# Altium project STM32G4_DRV8301_hardware.PrjPcb (part 4 of 5)

## Sheet DRV8301_SENSE.SchDoc
size 594 x 420 mm; SheetNumber: 7; SheetTotal: 9
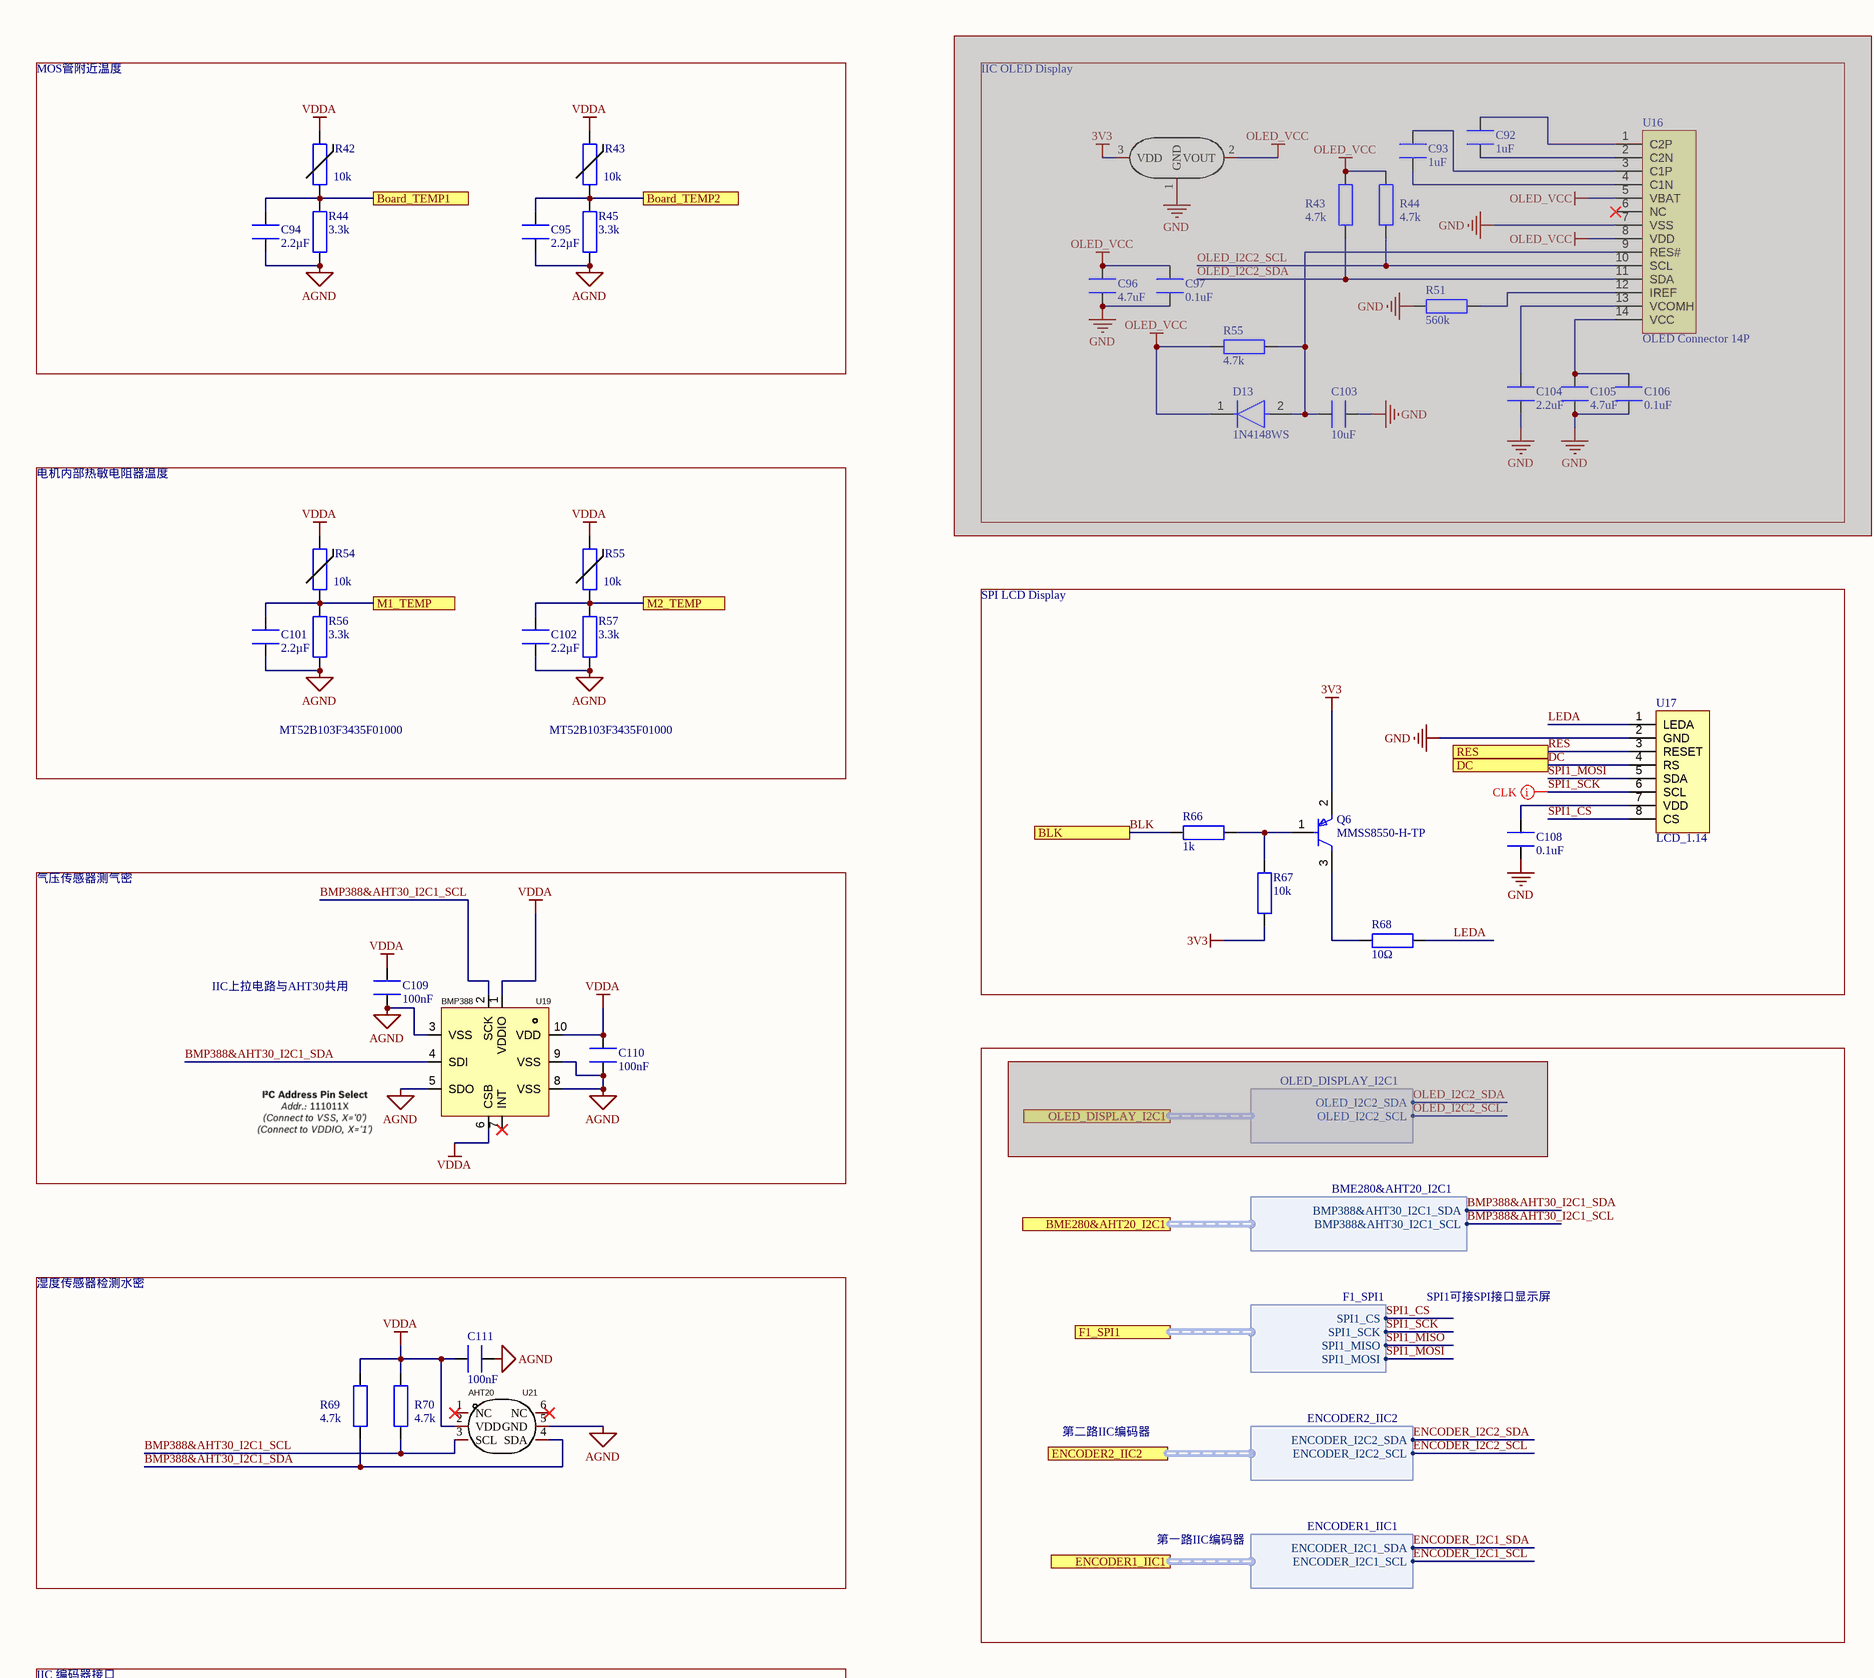
[diagram p9: DRV8301_SENSE.SchDoc, top left]
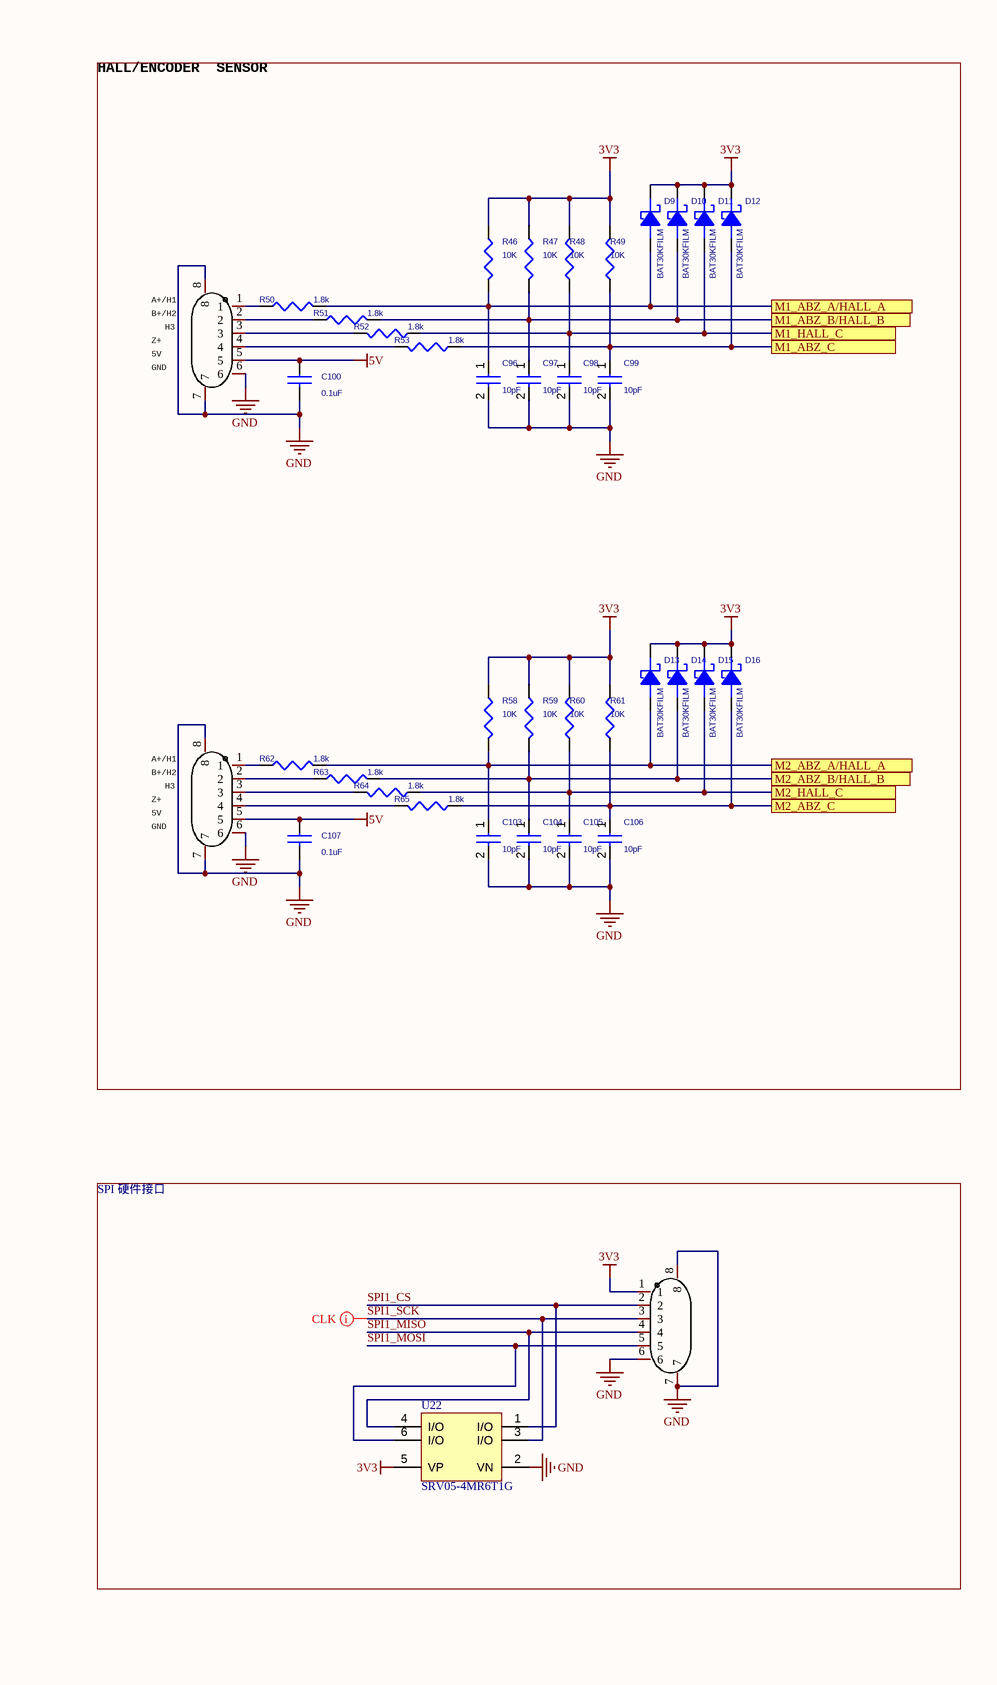
[diagram p10: DRV8301_SENSE.SchDoc, top right]
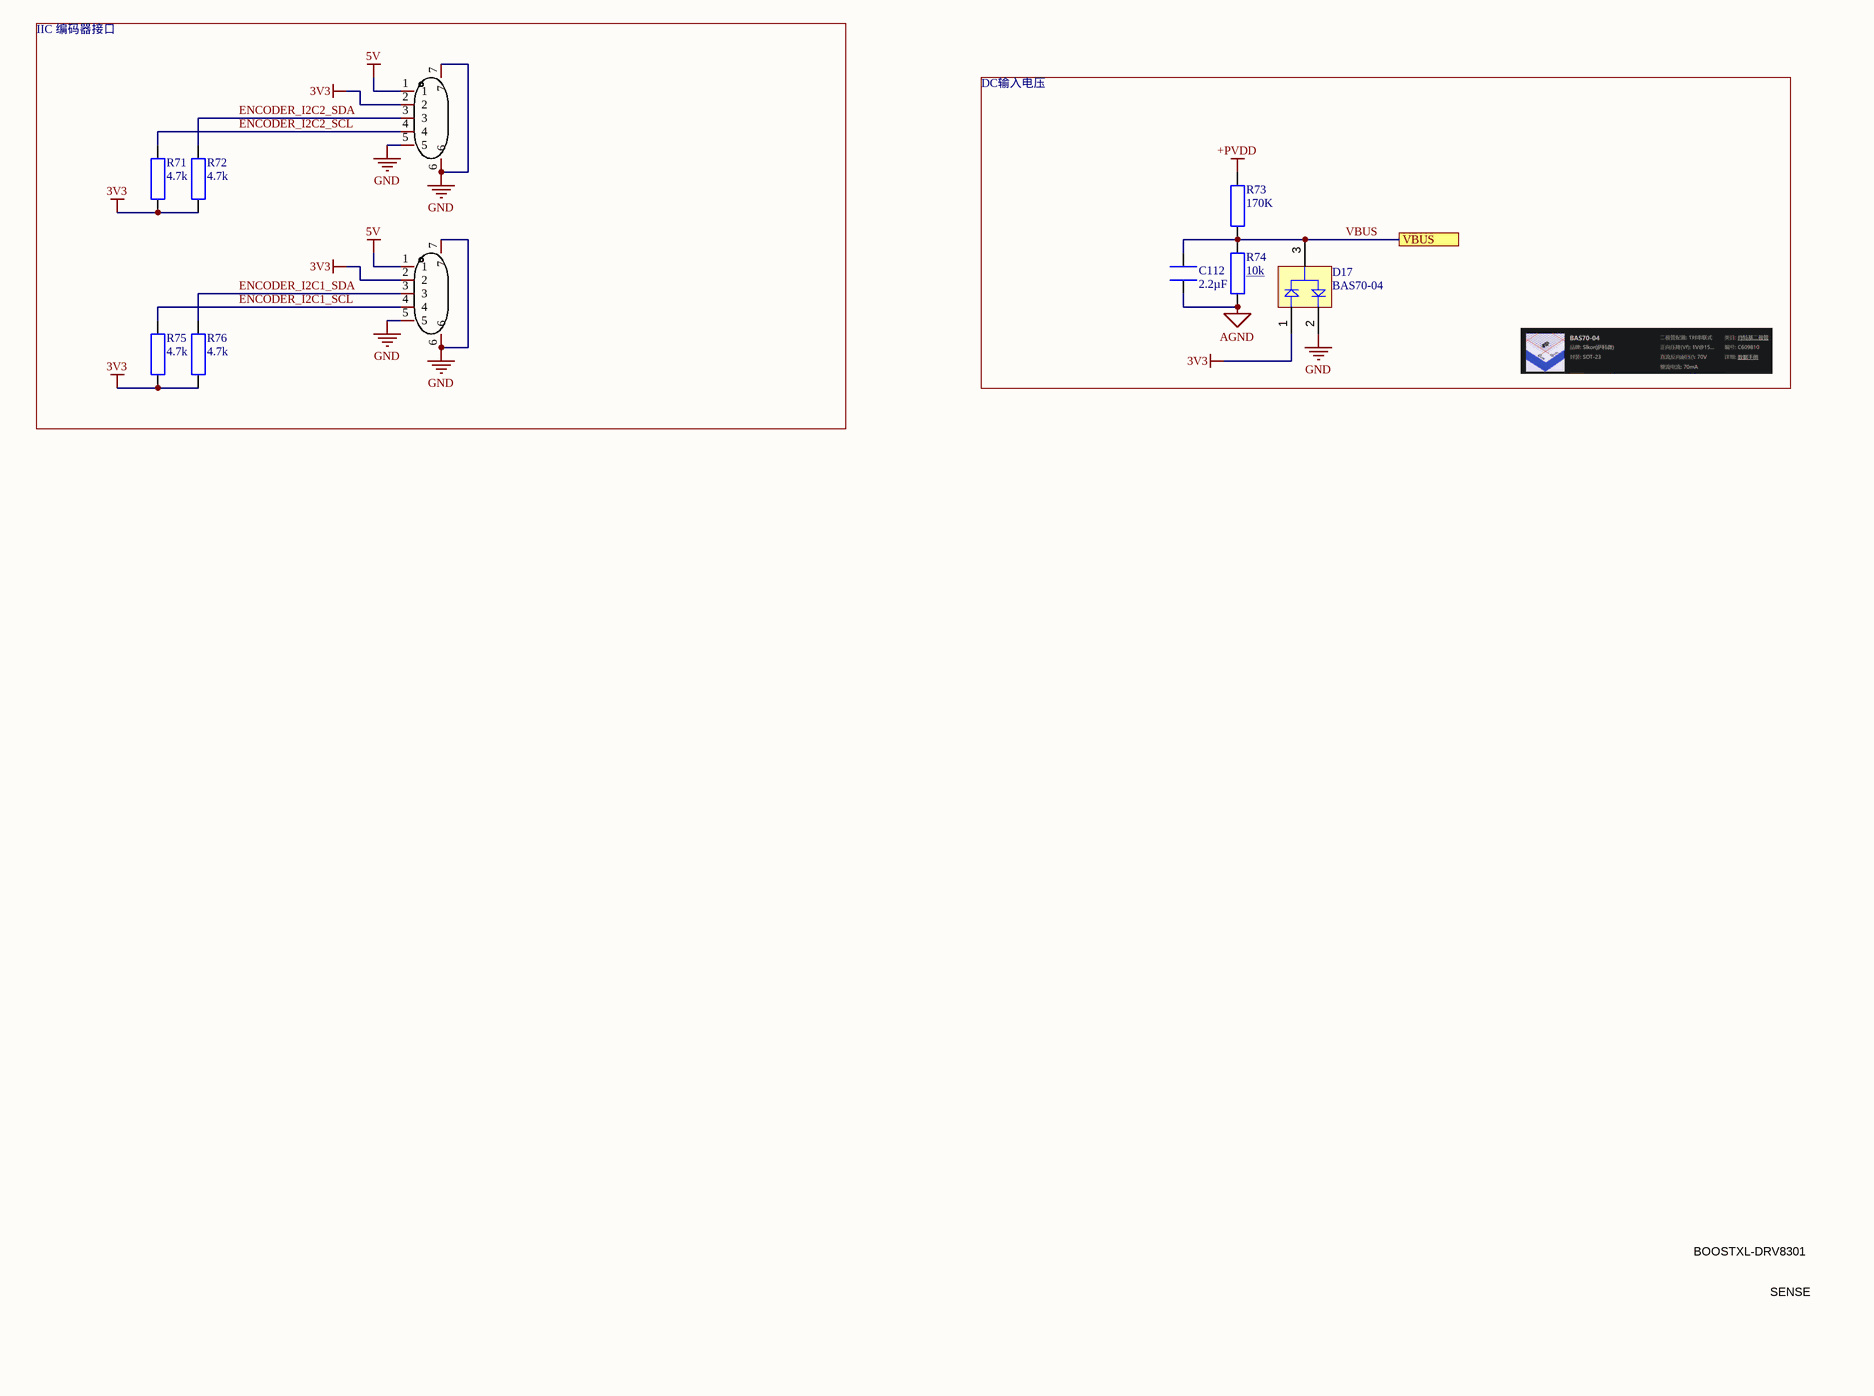
[diagram p11: DRV8301_SENSE.SchDoc, bottom left]
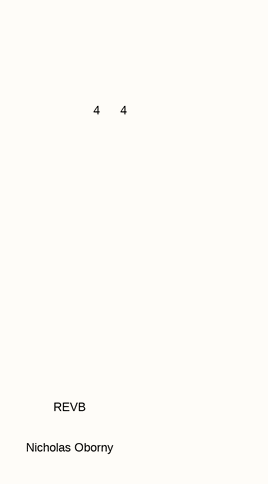
[diagram p12: DRV8301_SENSE.SchDoc, bottom right]

### Parts
(Parts that share a designator on the sheet are numbered #1, #2 ... from top to bottom, then left to right.)
C92#1  1uF  [CAPC1608X09L]  (masked out: inside a compile mask, not in the netlist)
C93#1  1uF  [CAPC1608X09L]  (masked out: inside a compile mask, not in the netlist)
C94  2.2µF  [CAPC1608X09L]
C95  2.2µF  [CAPC1608X09L]
C96#1  4.7uF  [CAPC1608X09L]  (masked out: inside a compile mask, not in the netlist)
C96#2  10pF  [C_0402]
C97#1  0.1uF  [CAPC1608X09L]  (masked out: inside a compile mask, not in the netlist)
C97#2  10pF  [C_0402]
C98  10pF  [C_0402]
C99  10pF  [C_0402]
C100  0.1uF  [C_0402]
C101  2.2µF  [CAPC1608X09L]
C102  2.2µF  [CAPC1608X09L]
C103#1  10uF  [CAPC1608X09L]  (masked out: inside a compile mask, not in the netlist)
C103#2  10pF  [C_0402]
C104#1  2.2uF  [CAPC1608X09L]  (masked out: inside a compile mask, not in the netlist)
C104#2  10pF  [C_0402]
C105#1  4.7uF  [CAPC1608X09L]  (masked out: inside a compile mask, not in the netlist)
C105#2  10pF  [C_0402]
C106#1  0.1uF  [CAPC1608X09L]  (masked out: inside a compile mask, not in the netlist)
C106#2  10pF  [C_0402]
C107  0.1uF  [C_0402]
C108  0.1uF  [CAPC1608X09L]
C109  100nF  [CAPC1608X09L]
C110  100nF  [CAPC1608X09L]
C111  100nF  [CAPC1608X09L]
C112  2.2µF  [CAPC1608X09L]
D9  BAT30KFILM  [sodfl160x80x65l30x30n]
D10  BAT30KFILM  [sodfl160x80x65l30x30n]
D11  BAT30KFILM  [sodfl160x80x65l30x30n]
D12  BAT30KFILM  [sodfl160x80x65l30x30n]
D13#1  1N4148WS  [FP-477AB-IPC_C]  (masked out: inside a compile mask, not in the netlist)
D13#2  BAT30KFILM  [sodfl160x80x65l30x30n]
D14  BAT30KFILM  [sodfl160x80x65l30x30n]
D15  BAT30KFILM  [sodfl160x80x65l30x30n]
D16  BAT30KFILM  [sodfl160x80x65l30x30n]
D17  BAS70-04  [INF-SOT23_N]
Q6  MMSS8550-H-TP  [FP-SOT-23-IPC_B]
R42  10k  [RESC1005X40N]
R43#1  10k  [RESC1005X40N]
R43#2  4.7k  [RESC1608X55N]  (masked out: inside a compile mask, not in the netlist)
R44#1  3.3k  [RESC1608X55N]
R44#2  4.7k  [RESC1608X55N]  (masked out: inside a compile mask, not in the netlist)
R45  3.3k  [RESC1608X55N]
R46  10K  [R_0402]
R47  10K  [R_0402]
R48  10K  [R_0402]
R49  10K  [R_0402]
R50  1.8k  [R_0402]
R51#1  560k  [RESC1608X55N]  (masked out: inside a compile mask, not in the netlist)
R51#2  1.8k  [R_0402]
R52  1.8k  [R_0402]
R53  1.8k  [R_0402]
R54  10k  [RESC1005X40N]
R55#1  4.7k  [RESC1608X55N]  (masked out: inside a compile mask, not in the netlist)
R55#2  10k  [RESC1005X40N]
R56  3.3k  [RESC1608X55N]
R57  3.3k  [RESC1608X55N]
R58  10K  [R_0402]
R59  10K  [R_0402]
R60  10K  [R_0402]
R61  10K  [R_0402]
R62  1.8k  [R_0402]
R63  1.8k  [R_0402]
R64  1.8k  [R_0402]
R65  1.8k  [R_0402]
R66  1k  [RESC1608X55N]
R67  10k  [RESC1608X55N]
R68  10Ω  [RESC1608X55N]
R69  4.7k  [RESC1608X55N]
R70  4.7k  [RESC1608X55N]
R71  4.7k  [RESC1608X55N]
R72  4.7k  [RESC1608X55N]
R73  170K  [RESC1608X55N]
R74  10k  [RESC1608X55N]
R75  4.7k  [RESC1608X55N]
R76  4.7k  [RESC1608X55N]
U16#1  OLED Connector 14P  [OLED 14P Connector]  (masked out: inside a compile mask, not in the netlist)
U16#2  WAFER-GH1.25-6PWB  [CONN-SMD_6P-P1.25_XUNPU_WAFER-GH1.25-6PWB]  (value not drawn)
U17#1  662K  [SOT-23-3_L2.9-W1.3-P1.90-LS2.4-BR]  (value not drawn)  (masked out: inside a compile mask, not in the netlist)
U17#2  LCD_1.14  [IPS 8P Connector]
U18  WAFER-GH1.25-6PWB  [CONN-SMD_6P-P1.25_XUNPU_WAFER-GH1.25-6PWB]  (value not drawn)
U19  BMP388  [SENSORM-SMD_BMP388]
U20  WAFER-GH1.25-6PWB  [CONN-SMD_6P-P1.25_XUNPU_WAFER-GH1.25-6PWB]  (value not drawn)
U21  AHT20  [SENSOR-SMD_L3.0-W3.0-P1.00-BR]
U22  SRV05-4MR6T1G  [ONSC-TSOP-6-318G-02_V]
U23  WAFER-GH1.25-5PWB  [CONN-SMD_5P-P1.25_XUNPU_WAFER-GH1.25-5PWB]  (value not drawn)
U24  WAFER-GH1.25-5PWB  [CONN-SMD_5P-P1.25_XUNPU_WAFER-GH1.25-5PWB]  (value not drawn)

### Blocks framed on the sheet
MOS管附近温度: C94 C95 R42 R43#1 R44#1 R45
IIC OLED Display: C92#1 C93#1 C96#1 C97#1 C103#1 C104#1 C105#1 C106#1 D13#1 R43#2 R44#2 R51#1 R55#1 U16#1 U17#1
HALL/ENCODER  SENSOR: C96#2 C97#2 C98-C100 C103#2 C104#2 C105#2 C106#2 C107 D9-D12 D13#2 D14-D16 R46-R50 R51#2 R52 R53 R58-R65 U16#2 U18
SPI LCD Display: C108 Q6 R66-R68 U17#2
SPI 硬件接口: U20 U22
湿度传感器检测水密: C111 R69 R70 U21
IIC 编码器接口: R71 R72 R75 R76 U23 U24
DC输入电压: C112 D17 R73 R74

### Ports
BLK (see STM32G4_DRV8301_hardware_TOP_V1.0[4A]), BME280&AHT20_I2C1 (harness BME280&AHT20_I2C1, see STM32G4_DRV8301_hardware_TOP_V1.0[4B], STM32F1_microcontroller[6B]), Board_TEMP1 (see STM32G4_DRV8301_hardware_TOP_V1.0[4A]), Board_TEMP2 (see STM32G4_DRV8301_hardware_TOP_V1.0[4A]), DC (see STM32G4_DRV8301_hardware_TOP_V1.0[4A]), ENCODER1_IIC1 (harness ENCODER1_IIC1, see STM32G4_DRV8301_hardware_TOP_V1.0[4B], STM32G4_microcontroller[6B]), ENCODER2_IIC2 (harness ENCODER2_IIC2, see STM32G4_DRV8301_hardware_TOP_V1.0[4B], STM32G4_microcontroller[1B]), F1_SPI1 (harness F1_SPI1, see STM32G4_DRV8301_hardware_TOP_V1.0[4B], STM32F1_microcontroller[1B]), M1_ABZ_A/HALL_A (see STM32G4_DRV8301_hardware_TOP_V1.0[4A]), M1_ABZ_B/HALL_B (see STM32G4_DRV8301_hardware_TOP_V1.0[4A]), M1_ABZ_C (see STM32G4_DRV8301_hardware_TOP_V1.0[4A]), M1_HALL_C (see STM32G4_DRV8301_hardware_TOP_V1.0[4A]), M1_TEMP (see STM32G4_DRV8301_hardware_TOP_V1.0[4A]), M2_ABZ_A/HALL_A (see STM32G4_DRV8301_hardware_TOP_V1.0[4A]), M2_ABZ_B/HALL_B (see STM32G4_DRV8301_hardware_TOP_V1.0[4A]), M2_ABZ_C (see STM32G4_DRV8301_hardware_TOP_V1.0[4B]), M2_HALL_C (see STM32G4_DRV8301_hardware_TOP_V1.0[4B]), M2_TEMP (see STM32G4_DRV8301_hardware_TOP_V1.0[4A]), OLED_DISPLAY_I2C1 (harness OLED_DISPLAY_I2C1, see STM32G4_DRV8301_hardware_TOP_V1.0[4B], STM32F1_microcontroller[6B]), RES (see STM32G4_DRV8301_hardware_TOP_V1.0[4A]), VBUS (see STM32G4_DRV8301_hardware_TOP_V1.0[4A])

### Harnesses
OLED_DISPLAY_I2C1: OLED_I2C2_SDA, OLED_I2C2_SCL
BME280&AHT20_I2C1: BMP388&AHT30_I2C1_SDA, BMP388&AHT30_I2C1_SCL
F1_SPI1: SPI1_CS, SPI1_SCK, SPI1_MISO, SPI1_MOSI
ENCODER2_IIC2: ENCODER_I2C2_SDA, ENCODER_I2C2_SCL
ENCODER1_IIC1: ENCODER_I2C1_SDA, ENCODER_I2C1_SCL

### Nets
3V3: D9.C D10.C D11.C D12.C D13#2.C D14.C D15.C D16.C D17.1(A1) Q6.2(E) R46.1 R47.1 R48.2 R49.2 R58.1 R59.1 R60.2 R61.2 R67.1 R71.2 R72.2 R75.2 R76.2 U20.1 U22.5(VP) U23.2 U24.2
5V: C100.1 C107.1 U16#2.5 U18.5 U23.1 U24.1
+PVDD: R73.2
AGND: C94.1 C95.1 C101.1 C102.1 C109.1 C110.1 C111.1 C112.1 R44#1.2 R45.2 R56.2 R57.2 R74.1 U19.3(VSS) U19.5(SDO) U19.8(VSS) U19.9(VSS) U21.5(GND)
GND: C96#2.2 C97#2.2 C98.2 C99.2 C100.2 C103#2.2 C104#2.2 C105#2.2 C106#2.2 C107.2 C108.1 D17.2(K2) U16#2.6 U16#2.7 U16#2.8 U17#2.2(GND) U18.6 U18.7 U18.8 U20.6 U20.7 U20.8 U22.2(VN) U23.5 U23.6 U23.7 U24.5 U24.6 U24.7
VDDA: C109.2 C110.2 C111.2 R42.2 R43#1.2 R54.2 R55#2.2 R69.2 R70.2 U19.1(VDDIO) U19.6(CSB) U19.10(VDD) U21.2(VDD)
BLK: R66.2 ; port BLK
BMP388&AHT30_I2C1_SCL: R70.1 U19.2(SCK) U21.3(SCL) ; port BME280&AHT20_I2C1.BMP388&AHT30_I2C1_SCL
BMP388&AHT30_I2C1_SDA: R69.1 U19.4(SDI) U21.4(SDA) ; port BME280&AHT20_I2C1.BMP388&AHT30_I2C1_SDA
DC: U17#2.4(RS) ; port DC
ENCODER_I2C1_SCL: R75.1 U24.4 ; port ENCODER1_IIC1.ENCODER_I2C1_SCL
ENCODER_I2C1_SDA: R76.1 U24.3 ; port ENCODER1_IIC1.ENCODER_I2C1_SDA
ENCODER_I2C2_SCL: R71.1 U23.4 ; port ENCODER2_IIC2.ENCODER_I2C2_SCL
ENCODER_I2C2_SDA: R72.1 U23.3 ; port ENCODER2_IIC2.ENCODER_I2C2_SDA
LEDA: R68.2 U17#2.1(LEDA)
RES: U17#2.3(RESET) ; port RES
SPI1_CS: U17#2.8(CS) U20.2 U22.1(I/O) ; port F1_SPI1.SPI1_CS
SPI1_MISO: U20.4 U22.4(I/O) ; port F1_SPI1.SPI1_MISO
SPI1_MOSI: U17#2.5(SDA) U20.5 U22.6(I/O) ; port F1_SPI1.SPI1_MOSI
SPI1_SCK: U17#2.6(SCL) U20.3 U22.3(I/O) ; port F1_SPI1.SPI1_SCK
VBUS: C112.2 D17.3(C) R73.1 R74.2 ; port VBUS
NetC94_2: C94.2 R42.1 R44#1.1 ; port Board_TEMP1
NetC95_2: C95.2 R43#1.1 R45.1 ; port Board_TEMP2
NetC96#2_1: C96#2.1 D9.A R46.2 R50.2 ; port M1_ABZ_A/HALL_A
NetC97#2_1: C97#2.1 D10.A R47.2 R51#2.2 ; port M1_ABZ_B/HALL_B
NetC98_1: C98.1 D11.A R48.1 R52.1 ; port M1_HALL_C
NetC99_1: C99.1 D12.A R49.1 R53.1 ; port M1_ABZ_C
NetC101_2: C101.2 R54.1 R56.1 ; port M1_TEMP
NetC102_2: C102.2 R55#2.1 R57.1 ; port M2_TEMP
NetC103#2_1: C103#2.1 D13#2.A R58.2 R62.2 ; port M2_ABZ_A/HALL_A
NetC104#2_1: C104#2.1 D14.A R59.2 R63.2 ; port M2_ABZ_B/HALL_B
NetC105#2_1: C105#2.1 D15.A R60.1 R64.1 ; port M2_HALL_C
NetC106#2_1: C106#2.1 D16.A R61.1 R65.1 ; port M2_ABZ_C
NetC108_2: C108.2 U17#2.7(VDD)
NetQ6_1: Q6.1(B) R66.1 R67.2
NetQ6_3: Q6.3(C) R68.1
NetR50_1: R50.1 U16#2.1
NetR51#2_1: R51#2.1 U16#2.2
NetR52_2: R52.2 U16#2.3
NetR53_2: R53.2 U16#2.4
NetR62_1: R62.1 U18.1
NetR63_1: R63.1 U18.2
NetR64_2: R64.2 U18.3
NetR65_2: R65.2 U18.4

Not connected (* = marked no-connect by the designer): U19 7(INT)*; U21 1(NC)* 6(NC)*

### Layout directives
mark named CLK: SPI1_SCK

### Notes on the sheet
- (near U16#2) A+/H1
- (near U16#2) 5V
- (near U16#2) B+/H2
- (near U16#2) GND
- (near U16#2) Z+
- (near U16#2) H3
- 电机内部热敏电阻器温度
- MT52B103F3435F01000
- (near U18) B+/H2
- (near U18) A+/H1
- (near U18) 5V
- (near U18) GND
- (near U18) Z+
- (near U18) H3
- 气压传感器测气密
- IIC上拉电路与AHT30共用
- SPI1可接SPI接口显示屏
- 第二路IIC编码器
- 第一路IIC编码器
- BOOSTXL-DRV8301
- SENSE
- 4
- REVB
- Nicholas Oborny
- DWG NO:
- REV:
- THIS DOCUMENT AND THE DATA DISCLOSED HEREIN OR
- HEREWITH IS THE PROPERTY OF ALTIUM LIMITED AND MAY
- BE FREELY DISTRIBUTED IN WHOLE. NO RIGHTS ARE
- RESERVED OR EXPRESS OR IMPLIED WARANTEE GIVEN.
- REVISION
- DESCRIPTION
- DATE
- APPROVED
- ENG:
- APPROVALS
- PROJECT
- DSN:
- CHK:
- REFERENCE DOCUMENTS
- PROJECT REVISION:
- TITLE
- DOCUMENT REVISION:
- DESIGN ITEM:
- BOM:
- FAB DWG:
- PCB DWG:
- ASSY DWG:
- SCALE:
- A2
- SIZE
- CAGE CODE
- FILE NAME
- DWG NO.
- SHEET
- OF
- REV

### Library data of the parts
C92#1 C93#1 = GRM188R61C225KE15D: CAP CER 1UF 16V X5R 0603; Manufacturer: Murata Electronics North America; Capacitance: 2.2µF; Tolerance: ±10%; Supplier 1: Digi-Key; Supplier Part Number 1: 490-3296-1-ND; Manufacturer Part Number: GRM188R61C225KE15D; RoHS: RoHS Compliant; Category: Capacitors; Stock 1: 1255740; Pricing 1: 1=0.12, 10=0.08, 50=0.046, 100=0.038, 250=0.032, 500=0.0268, 1000=0.022 (USD); Packaging: Cut Tape (CT); Voltage - Rated: 16V; Temperature Coefficient: X5R; Mounting Type: Surface Mount, MLCC; Operating Temperature: -55°C ~ 85°C; Applications: General Purpose; Ratings: -; Package / Case: 0603 (1608 Metric); Size / Dimension: 0.063" L x 0.031" W (1.60mm x 0.80mm); Height - Seated (Max): -; Thickness (Max): 0.035" (0.90mm); Lead Spacing: -; Features: -; Lead Style: -; ComponentLink1URL: http://www.murata.com/~/media/webrenewal/support/library/catalog/products/capacitor/mlcc/c02e.pdf; ComponentLink1Description: http://www.murata.com/~/media/webrenewal/support/library/catalog/products/capacitor/mlcc/c02e.pdf
C94 C95 C101 C102 C112 = GRM188R61C225KE15D: CAP CER 2.2UF 16V X5R 0603; Manufacturer: Murata Electronics North America; Tolerance: ±10%; Supplier 1: Digi-Key; Supplier Part Number 1: 490-3296-1-ND; Manufacturer Part Number: GRM188R61C225KE15D; RoHS: RoHS Compliant; Category: Capacitors; Stock 1: 1255740; Pricing 1: 1=0.12, 10=0.08, 50=0.046, 100=0.038, 250=0.032, 500=0.0268, 1000=0.022 (USD); Packaging: Cut Tape (CT); Capacitance: 2.2µF; Voltage - Rated: 16V; Temperature Coefficient: X5R; Mounting Type: Surface Mount, MLCC; Operating Temperature: -55°C ~ 85°C; Applications: General Purpose; Ratings: -; Package / Case: 0603 (1608 Metric); Size / Dimension: 0.063" L x 0.031" W (1.60mm x 0.80mm); Height - Seated (Max): -; Thickness (Max): 0.035" (0.90mm); Lead Spacing: -; Features: -; Lead Style: -; ComponentLink1URL: http://www.murata.com/~/media/webrenewal/support/library/catalog/products/capacitor/mlcc/c02e.pdf; ComponentLink1Description: http://www.murata.com/~/media/webrenewal/support/library/catalog/products/capacitor/mlcc/c02e.pdf
C96#1 C105#1 = GRM188R61C225KE15D: CAP CER 4.7UF 16V X5R 0603; Manufacturer: Murata Electronics North America; Capacitance: 2.2µF; Tolerance: ±10%; Supplier 1: Digi-Key; Supplier Part Number 1: 490-3296-1-ND; Manufacturer Part Number: GRM188R61C225KE15D; RoHS: RoHS Compliant; Category: Capacitors; Stock 1: 1255740; Pricing 1: 1=0.12, 10=0.08, 50=0.046, 100=0.038, 250=0.032, 500=0.0268, 1000=0.022 (USD); Packaging: Cut Tape (CT); Voltage - Rated: 16V; Temperature Coefficient: X5R; Mounting Type: Surface Mount, MLCC; Operating Temperature: -55°C ~ 85°C; Applications: General Purpose; Ratings: -; Package / Case: 0603 (1608 Metric); Size / Dimension: 0.063" L x 0.031" W (1.60mm x 0.80mm); Height - Seated (Max): -; Thickness (Max): 0.035" (0.90mm); Lead Spacing: -; Features: -; Lead Style: -; ComponentLink1URL: http://www.murata.com/~/media/webrenewal/support/library/catalog/products/capacitor/mlcc/c02e.pdf; ComponentLink1Description: http://www.murata.com/~/media/webrenewal/support/library/catalog/products/capacitor/mlcc/c02e.pdf
C96#2 C97#2 C98 C99 C103#2 C104#2 C105#2 C106#2 = CAP: CAP CER 10PF 10V C0G/NP0 0402; Manufacturer PN: 885012005007; Manufacturer: Wurth Electronics Inc.; PART_NUMBER: TMP-395; CLASS: DISCRETE; Tolerance: 5%; Temperature Coefficient: C0G, NP0; Dielectric Type: Capacitors; Rated Voltage: 10V; Package Size: 0402 (1005 Metric)
C97#1 C106#1 C108 = GRM188R61C225KE15D: CAP CER 0.1UF 16V X5R 0603; Manufacturer: Murata Electronics North America; Capacitance: 2.2µF; Tolerance: ±10%; Supplier 1: Digi-Key; Supplier Part Number 1: 490-3296-1-ND; Manufacturer Part Number: GRM188R61C225KE15D; RoHS: RoHS Compliant; Category: Capacitors; Stock 1: 1255740; Pricing 1: 1=0.12, 10=0.08, 50=0.046, 100=0.038, 250=0.032, 500=0.0268, 1000=0.022 (USD); Packaging: Cut Tape (CT); Voltage - Rated: 16V; Temperature Coefficient: X5R; Mounting Type: Surface Mount, MLCC; Operating Temperature: -55°C ~ 85°C; Applications: General Purpose; Ratings: -; Package / Case: 0603 (1608 Metric); Size / Dimension: 0.063" L x 0.031" W (1.60mm x 0.80mm); Height - Seated (Max): -; Thickness (Max): 0.035" (0.90mm); Lead Spacing: -; Features: -; Lead Style: -; ComponentLink1URL: http://www.murata.com/~/media/webrenewal/support/library/catalog/products/capacitor/mlcc/c02e.pdf; ComponentLink1Description: http://www.murata.com/~/media/webrenewal/support/library/catalog/products/capacitor/mlcc/c02e.pdf
C100 C107 = CAP_4: CAP CER 0.1UF 16V X7R 0402; Manufacturer PN: 885012205037; Manufacturer: Wurth Electronics Inc.; PART_NUMBER: CAP-00000053; CLASS: DISCRETE; Tolerance: 10%; Dielectric Type: Capacitors; Rated Voltage: 16V; Temperature Coefficient: X7R; Package Size: 0402 (1005 Metric)
C103#1 = GRM188R61C225KE15D: CAP CER 10UF 16V X5R 0603; Manufacturer: Murata Electronics North America; Capacitance: 2.2µF; Tolerance: ±10%; Supplier 1: Digi-Key; Supplier Part Number 1: 490-3296-1-ND; Manufacturer Part Number: GRM188R61C225KE15D; RoHS: RoHS Compliant; Category: Capacitors; Stock 1: 1255740; Pricing 1: 1=0.12, 10=0.08, 50=0.046, 100=0.038, 250=0.032, 500=0.0268, 1000=0.022 (USD); Packaging: Cut Tape (CT); Voltage - Rated: 16V; Temperature Coefficient: X5R; Mounting Type: Surface Mount, MLCC; Operating Temperature: -55°C ~ 85°C; Applications: General Purpose; Ratings: -; Package / Case: 0603 (1608 Metric); Size / Dimension: 0.063" L x 0.031" W (1.60mm x 0.80mm); Height - Seated (Max): -; Thickness (Max): 0.035" (0.90mm); Lead Spacing: -; Features: -; Lead Style: -; ComponentLink1URL: http://www.murata.com/~/media/webrenewal/support/library/catalog/products/capacitor/mlcc/c02e.pdf; ComponentLink1Description: http://www.murata.com/~/media/webrenewal/support/library/catalog/products/capacitor/mlcc/c02e.pdf
C104#1 = GRM188R61C225KE15D: CAP CER 2.2UF 16V X5R 0603; Manufacturer: Murata Electronics North America; Capacitance: 2.2µF; Tolerance: ±10%; Supplier 1: Digi-Key; Supplier Part Number 1: 490-3296-1-ND; Manufacturer Part Number: GRM188R61C225KE15D; RoHS: RoHS Compliant; Category: Capacitors; Stock 1: 1255740; Pricing 1: 1=0.12, 10=0.08, 50=0.046, 100=0.038, 250=0.032, 500=0.0268, 1000=0.022 (USD); Packaging: Cut Tape (CT); Voltage - Rated: 16V; Temperature Coefficient: X5R; Mounting Type: Surface Mount, MLCC; Operating Temperature: -55°C ~ 85°C; Applications: General Purpose; Ratings: -; Package / Case: 0603 (1608 Metric); Size / Dimension: 0.063" L x 0.031" W (1.60mm x 0.80mm); Height - Seated (Max): -; Thickness (Max): 0.035" (0.90mm); Lead Spacing: -; Features: -; Lead Style: -; ComponentLink1URL: http://www.murata.com/~/media/webrenewal/support/library/catalog/products/capacitor/mlcc/c02e.pdf; ComponentLink1Description: http://www.murata.com/~/media/webrenewal/support/library/catalog/products/capacitor/mlcc/c02e.pdf
C109-C111 = GRM188R61C225KE15D: CAP CER 100nF 16V X5R 0603; Manufacturer: Murata Electronics North America; Capacitance: 2.2µF; Tolerance: ±10%; Supplier 1: Digi-Key; Supplier Part Number 1: 490-3296-1-ND; Manufacturer Part Number: GRM188R61C225KE15D; RoHS: RoHS Compliant; Category: Capacitors; Stock 1: 1255740; Pricing 1: 1=0.12, 10=0.08, 50=0.046, 100=0.038, 250=0.032, 500=0.0268, 1000=0.022 (USD); Packaging: Cut Tape (CT); Voltage - Rated: 16V; Temperature Coefficient: X5R; Mounting Type: Surface Mount, MLCC; Operating Temperature: -55°C ~ 85°C; Applications: General Purpose; Ratings: -; Package / Case: 0603 (1608 Metric); Size / Dimension: 0.063" L x 0.031" W (1.60mm x 0.80mm); Height - Seated (Max): -; Thickness (Max): 0.035" (0.90mm); Lead Spacing: -; Features: -; Lead Style: -; ComponentLink1URL: http://www.murata.com/~/media/webrenewal/support/library/catalog/products/capacitor/mlcc/c02e.pdf; ComponentLink1Description: http://www.murata.com/~/media/webrenewal/support/library/catalog/products/capacitor/mlcc/c02e.pdf
D9 D11 D12 D13#2 D15 D16 = DIODE_SCHOTTKY_0: DIODE SCHOTTKY 30V 300MA SOD523; Manufacturer: STMicroelectronics; PART_NUMBER: TMP-46; CLASS: DISCRETE; Rated Voltage: 530mV @ 300mA; Manufacturer PN: BAT30KFILM; Package Size: SC-79, SOD-523
D10 D14 = DIODE_SCHOTTKY_0: DIODE SCHOTTKY 30V 300MA SOD523; PART_NUMBER: TMP-46; Manufacturer: STMicroelectronics; Rated Voltage: 530mV @ 300mA; CLASS: DISCRETE; Package Size: SC-79, SOD-523; Manufacturer PN: BAT30KFILM
D13#1 = CMP-07163-000040-1: DIODE GEN PURP 75V 150MA SOD323F; Forward Voltage: 1V; Power Dissipation: 200mW; Element Configuration: Single; Max Forward Surge Current (Ifsm): 2A; Peak Reverse Current: 5uA; Recovery Time: 4ns; Package Quantity: 1; Number of Pins: 2; Height: 1mm; REACH SVHC: No SVHC; Max Reverse Voltage (DC): 75V; Forward Current: 150mA; Length: 1.8mm; Max Repetitive Reverse Voltage (Vrrm): 75V; Max Operating Temperature: 150°C; Average Rectified Current: 150mA; Contact Plating: Tin; Packaging: Tape and Reel; Radiation Hardening: No; Min Operating Temperature: -55°C; Width: 1.35mm; Weight: 0.0276g; Lead Free: Lead Free; Mount: Surface Mount; Reverse Voltage: 75V; Reverse Recovery Time: 4ns
D17 = CMP-1182-00019-1: Silicon Schottky Diode, -55 to 125 degC, SOT23, Reel, Green; Manufacturer: Infineon; Configuration: Dual; IF (max): 70Â mA; VF (max): 1,000Â mV; CT (max): 2Â pF; VR (max): 70Â V; Green: TRUE; Packing: Reel; ComponentLink2Description: Datasheet; PartNumber: BAS70-04; PackageDescription: 3-Pin Small Outline Transistor Package, 1.3 x 2.9 mm Body, 0.95 mm Pitch; ComponentLink1URL: http://www.infineon.com/; ComponentLink3Description: Package Specification; PackageVersion: Apr-08; ComponentLink2URL: http://www.infineon.com/dgdl/bas70_bas170series.pdf?folderId=db3a30431400ef68011425f1ca2505e3&fileId=db3a304314dca389011518ad41680e12; ComponentLink3URL: http://www.infineon.com/dgdl/SOT23-Package_Overview.pdf?folderId=db3a30431936bc4b0119532290053c66&fileId=db3a30431936bc4b0119533468123c85; Mounting Technology: Surface Mount; ComponentLink1Description: Manufacturer URL; PackageReference: SOT23
Q6 = CMP-56214-000002-1: TRANS PNP 25V 1.5A SOT23; Emitter Base Voltage (VEBO): 1.6V; Collector Base Voltage (VCBO): 40V; Collector Emitter Saturation Voltage: 500mV; Max Power Dissipation: 625mW; Transition Frequency: 100MHz; Element Configuration: Single; hFE Min: 40; Polarity: PNP; Lead Free: Lead Free; Max Breakdown Voltage: 25V; Package Quantity: 1; Min Operating Temperature: -55°C; Case/Package: SOT-23; Max Collector Current: 1.5A; Mount: Surface Mount; Packaging: Tape and Reel; Collector Emitter Voltage (VCEO): 500mV; Max Operating Temperature: 150°C; Gain Bandwidth Product: 100MHz; Collector Emitter Breakdown Voltage: 25V
R42 R43#1 R54 R55#2 = NCP15XH103F03RC: THERMISTOR 10K OHM NTC 0402 SMD; Value: 10k
R43#2 R44#2 R55#1 R69-R72 R75 R76 = RC0603FR-073K3L: RES SMD 4.7K OHM 1% 1/10W 0603; Manufacturer: Yageo; Resistance (Ohms): 3.3k; Power (Watts): 0.1W, 1/10W; Temperature Coefficient: ±100ppm/°C; Supplier 1: Digi-Key; Supplier Part Number 1: 311-3.30KHRCT-ND; Manufacturer Part Number: RC0603FR-073K3L; RoHS: RoHS Compliant; Category: Resistors; Stock 1: 420019; Pricing 1: 1=0.1, 10=0.014, 25=0.01, 100=0.0057, 250=0.00436, 500=0.00348, 1000=0.00257, 2500=0.00223 (USD); Packaging: Cut Tape (CT); Tolerance: ±1%; Composition: Thick Film; Features: Moisture Resistant; Operating Temperature: -55°C ~ 155°C; Package / Case: 0603 (1608 Metric); Supplier Device Package: 0603; Size / Dimension: 0.063" L x 0.031" W (1.60mm x 0.80mm); Height: 0.022" (0.55mm); Number of Terminations: 2; ComponentLink1URL: http://www.yageo.com/documents/recent/PYu-RC_Group_51_RoHS_L_04.pdf; ComponentLink1Description: http://www.yageo.com/documents/recent/PYu-RC_Group_51_RoHS_L_04.pdf
R44#1 R45 R56 R57 = RC0603FR-073K3L: RES SMD 3.3K OHM 1% 1/10W 0603; Manufacturer: Yageo; Power (Watts): 0.1W, 1/10W; Temperature Coefficient: ±100ppm/°C; Supplier 1: Digi-Key; Supplier Part Number 1: 311-3.30KHRCT-ND; Manufacturer Part Number: RC0603FR-073K3L; RoHS: RoHS Compliant; Category: Resistors; Stock 1: 420019; Pricing 1: 1=0.1, 10=0.014, 25=0.01, 100=0.0057, 250=0.00436, 500=0.00348, 1000=0.00257, 2500=0.00223 (USD); Packaging: Cut Tape (CT); Resistance (Ohms): 3.3k; Tolerance: ±1%; Composition: Thick Film; Features: Moisture Resistant; Operating Temperature: -55°C ~ 155°C; Package / Case: 0603 (1608 Metric); Supplier Device Package: 0603; Size / Dimension: 0.063" L x 0.031" W (1.60mm x 0.80mm); Height: 0.022" (0.55mm); Number of Terminations: 2; ComponentLink1URL: http://www.yageo.com/documents/recent/PYu-RC_Group_51_RoHS_L_04.pdf; ComponentLink1Description: http://www.yageo.com/documents/recent/PYu-RC_Group_51_RoHS_L_04.pdf
R46 R58 = RES: RES SMD 10K OHM 1% 1/16W 0402; PART_NUMBER: TMP-396; Manufacturer: Yageo; Manufacturer PN: RC0402FR-0710KL; Temperature Coefficient: 100ppm/C; Rated Power: 0.063W, 1/16W; CLASS: DISCRETE; Package Size: 0402 (1005 Metric); Tolerance: 1%
R47-R49 R59-R61 = RES: RES SMD 10K OHM 1% 1/16W 0402; Manufacturer PN: RC0402FR-0710KL; Manufacturer: Yageo; PART_NUMBER: TMP-396; CLASS: DISCRETE; Rated Power: 0.063W, 1/16W; Temperature Coefficient: 100ppm/C; Tolerance: 1%; Package Size: 0402 (1005 Metric)
R50 R62 = RES: RES SMD 1.8K OHM 1% 1/16W 0402; Manufacturer PN: RC0402FR-071K8L; Manufacturer: Yageo; PART_NUMBER: TMP-394; CLASS: DISCRETE; Rated Power: 0.063W, 1/16W; Temperature Coefficient: 100ppm/C; Tolerance: 1%; Package Size: 0402 (1005 Metric)
R51#1 = RC0603FR-073K3L: RES SMD 560K OHM 1% 1/10W 0603; Manufacturer: Yageo; Resistance (Ohms): 3.3k; Power (Watts): 0.1W, 1/10W; Temperature Coefficient: ±100ppm/°C; Supplier 1: Digi-Key; Supplier Part Number 1: 311-3.30KHRCT-ND; Manufacturer Part Number: RC0603FR-073K3L; RoHS: RoHS Compliant; Category: Resistors; Stock 1: 420019; Pricing 1: 1=0.1, 10=0.014, 25=0.01, 100=0.0057, 250=0.00436, 500=0.00348, 1000=0.00257, 2500=0.00223 (USD); Packaging: Cut Tape (CT); Tolerance: ±1%; Composition: Thick Film; Features: Moisture Resistant; Operating Temperature: -55°C ~ 155°C; Package / Case: 0603 (1608 Metric); Supplier Device Package: 0603; Size / Dimension: 0.063" L x 0.031" W (1.60mm x 0.80mm); Height: 0.022" (0.55mm); Number of Terminations: 2; ComponentLink1URL: http://www.yageo.com/documents/recent/PYu-RC_Group_51_RoHS_L_04.pdf; ComponentLink1Description: http://www.yageo.com/documents/recent/PYu-RC_Group_51_RoHS_L_04.pdf
R51#2 R52 R53 R63-R65 = RES: RES SMD 1.8K OHM 1% 1/16W 0402; PART_NUMBER: TMP-394; Manufacturer: Yageo; Manufacturer PN: RC0402FR-071K8L; Temperature Coefficient: 100ppm/C; Rated Power: 0.063W, 1/16W; CLASS: DISCRETE; Package Size: 0402 (1005 Metric); Tolerance: 1%
R66 = RC0603FR-073K3L: RES SMD 1K OHM 1% 1/10W 0603; Manufacturer: Yageo; Resistance (Ohms): 3.3k; Power (Watts): 0.1W, 1/10W; Temperature Coefficient: ±100ppm/°C; Supplier 1: Digi-Key; Supplier Part Number 1: 311-3.30KHRCT-ND; Manufacturer Part Number: RC0603FR-073K3L; RoHS: RoHS Compliant; Category: Resistors; Stock 1: 420019; Pricing 1: 1=0.1, 10=0.014, 25=0.01, 100=0.0057, 250=0.00436, 500=0.00348, 1000=0.00257, 2500=0.00223 (USD); Packaging: Cut Tape (CT); Tolerance: ±1%; Composition: Thick Film; Features: Moisture Resistant; Operating Temperature: -55°C ~ 155°C; Package / Case: 0603 (1608 Metric); Supplier Device Package: 0603; Size / Dimension: 0.063" L x 0.031" W (1.60mm x 0.80mm); Height: 0.022" (0.55mm); Number of Terminations: 2; ComponentLink1URL: http://www.yageo.com/documents/recent/PYu-RC_Group_51_RoHS_L_04.pdf; ComponentLink1Description: http://www.yageo.com/documents/recent/PYu-RC_Group_51_RoHS_L_04.pdf
R67 = RC0603FR-073K3L: RES SMD 10K OHM 1% 1/10W 0603; Manufacturer: Yageo; Resistance (Ohms): 3.3k; Power (Watts): 0.1W, 1/10W; Temperature Coefficient: ±100ppm/°C; Supplier 1: Digi-Key; Supplier Part Number 1: 311-3.30KHRCT-ND; Manufacturer Part Number: RC0603FR-073K3L; RoHS: RoHS Compliant; Category: Resistors; Stock 1: 420019; Pricing 1: 1=0.1, 10=0.014, 25=0.01, 100=0.0057, 250=0.00436, 500=0.00348, 1000=0.00257, 2500=0.00223 (USD); Packaging: Cut Tape (CT); Tolerance: ±1%; Composition: Thick Film; Features: Moisture Resistant; Operating Temperature: -55°C ~ 155°C; Package / Case: 0603 (1608 Metric); Supplier Device Package: 0603; Size / Dimension: 0.063" L x 0.031" W (1.60mm x 0.80mm); Height: 0.022" (0.55mm); Number of Terminations: 2; ComponentLink1URL: http://www.yageo.com/documents/recent/PYu-RC_Group_51_RoHS_L_04.pdf; ComponentLink1Description: http://www.yageo.com/documents/recent/PYu-RC_Group_51_RoHS_L_04.pdf
R68 = RC0603FR-073K3L: RES SMD 10Ω OHM 1% 1/10W 0603; Manufacturer: Yageo; Resistance (Ohms): 3.3k; Power (Watts): 0.1W, 1/10W; Temperature Coefficient: ±100ppm/°C; Supplier 1: Digi-Key; Supplier Part Number 1: 311-3.30KHRCT-ND; Manufacturer Part Number: RC0603FR-073K3L; RoHS: RoHS Compliant; Category: Resistors; Stock 1: 420019; Pricing 1: 1=0.1, 10=0.014, 25=0.01, 100=0.0057, 250=0.00436, 500=0.00348, 1000=0.00257, 2500=0.00223 (USD); Packaging: Cut Tape (CT); Tolerance: ±1%; Composition: Thick Film; Features: Moisture Resistant; Operating Temperature: -55°C ~ 155°C; Package / Case: 0603 (1608 Metric); Supplier Device Package: 0603; Size / Dimension: 0.063" L x 0.031" W (1.60mm x 0.80mm); Height: 0.022" (0.55mm); Number of Terminations: 2; ComponentLink1URL: http://www.yageo.com/documents/recent/PYu-RC_Group_51_RoHS_L_04.pdf; ComponentLink1Description: http://www.yageo.com/documents/recent/PYu-RC_Group_51_RoHS_L_04.pdf
R73 = RC0603FR-0710KL: RES SMD 10K OHM 1% 1/10W 0603; Manufacturer: Yageo; Power (Watts): 0.1W, 1/10W; Temperature Coefficient: ±100ppm/°C; Supplier 1: Digi-Key; Supplier Part Number 1: 311-10.0KHRCT-ND; Manufacturer Part Number: RC0603FR-0710KL; RoHS: RoHS Compliant; Category: Resistors; Stock 1: 13504930; Pricing 1: 1=0.1, 10=0.014, 25=0.01, 100=0.0057, 250=0.00436, 500=0.00348, 1000=0.00257, 2500=0.00223 (USD); Packaging: Cut Tape (CT); Resistance (Ohms): 10k; Tolerance: ±1%; Composition: Thick Film; Features: Moisture Resistant; Operating Temperature: -55°C ~ 155°C; Package / Case: 0603 (1608 Metric); Supplier Device Package: 0603; Size / Dimension: 0.063" L x 0.031" W (1.60mm x 0.80mm); Height: 0.022" (0.55mm); Number of Terminations: 2; ComponentLink1URL: http://www.yageo.com/documents/recent/PYu-RC_Group_51_RoHS_L_04.pdf; ComponentLink1Description: http://www.yageo.com/documents/recent/PYu-RC_Group_51_RoHS_L_04.pdf
R74 = RC0603FR-071KL: RES SMD 1K OHM 1% 1/10W 0603; Manufacturer: Yageo; Power (Watts): 0.1W, 1/10W; Temperature Coefficient: ±100ppm/°C; Supplier 1: Digi-Key; Supplier Part Number 1: 311-1.00KHRCT-ND; RoHS: RoHS Compliant; Category: Resistors; Stock 1: 6734836; Pricing 1: 1=0.1, 10=0.014, 25=0.01, 100=0.0057, 250=0.00436, 500=0.00348, 1000=0.00257, 2500=0.00223 (USD); Packaging: Cut Tape (CT); Tolerance: ±1%; Composition: Thick Film; Features: Moisture Resistant; Operating Temperature: -55°C ~ 155°C; Package / Case: 0603 (1608 Metric); Supplier Device Package: 0603; Size / Dimension: 0.063" L x 0.031" W (1.60mm x 0.80mm); Height: 0.022" (0.55mm); Number of Terminations: 2; ComponentLink1URL: http://www.yageo.com/documents/recent/PYu-RC_Group_51_RoHS_L_04.pdf; ComponentLink1Description: http://www.yageo.com/documents/recent/PYu-RC_Group_51_RoHS_L_04.pdf; Manufacturer Part Number: RC0603FR-071KL; Resistance (Ohms): 1k
U16#2 U18 U20 = WAFER-GH1.25-6PWB: Manufacturer: XUNPU(讯普); Add into BOM: yes; Pins Structure: 1x6P; Pitch: 1.25mm; Reference Series: GH; Number of PINs Per Row: 6; Current Rating (Max): 1A; Symbol: WAFER-GH1.25-6PWB; Device: WAFER-GH1.25-6PWB; LCSC Part Name: 1x6P 间距:1.25mm 卧贴 系列:GH; Supplier Part: C3029381; Manufacturer Part: WAFER-GH1.25-6PWB; Supplier Footprint: SMD,P=1.25mm,卧贴; JLCPCB Part Class: Extended Part; Datasheet: https://atta.szlcsc.com/upload/public/pdf/source/20220527/CB8773BFB0913C3B8ABD62CB38BA101A.pdf; Supplier: LCSC; Convert to PCB: yes; Mounting Style: 卧贴; Number of Pins: 6P; Number of Rows: 1; Operating Temperature Range: -25℃~+85℃
U17#1 = 662K: Manufacturer: HXY MOSFET(华轩阳电子); Add into BOM: yes; Output Type: 固定; Maximum Input Voltage: 8V; Output Voltage: 3.3V; MAX Output Current: 300mA; Output Polarity: 正极; Number of Outputs: 1; Symbol: 662K; Device: 662K; LCSC Part Name: 662K. 输入8V 300mA; Supplier Part: C7470756; Manufacturer Part: 662K; Supplier Footprint: SOT-23; JLCPCB Part Class: Extended Part; Datasheet: https://atta.szlcsc.com/upload/public/pdf/source/20230915/BA72989D17401E2852D389BF12EDF43F.pdf; Supplier: LCSC; Convert to PCB: yes
U17#2 = LCD_1.14: 1.14寸 LCD屏幕; Add into BOM: yes; Symbol: LCD_1.14; Device: LCD_1.14; Convert to PCB: yes
U19 = BMP388: Manufacturer: Bosch(博世); Add into BOM: yes; Pressure range: 30Kpa~125Kpa; The Power Supply Voltage: 1.65V~3.6V; Symbol: BMP388; Device: BMP388; LCSC Part Name: BMP388; Supplier Part: C779278; Manufacturer Part: BMP388; Supplier Footprint: LGA-10(2x2); JLCPCB Part Class: Extended Part; Datasheet: https://atta.szlcsc.com/upload/public/pdf/source/20211019/91C230A1D32F1E776DA878FFB43C8B15.pdf; Supplier: LCSC; Convert to PCB: yes; Operating Temperature: -
U21 = AHT20: Manufacturer: 广州奥松; Symbol: AHT20_C2757850; Add into BOM: yes; Device: AHT20; LCSC Part Name: AHT20; Supplier Part: C2757850; Manufacturer Part: AHT20; Supplier Footprint: SMD; JLCPCB Part Class: Extended Part; Datasheet: https://atta.szlcsc.com/upload/public/pdf/source/20231023/00557B34ED120268320A4810FF8DED4D.pdf; Supplier: LCSC; Convert to PCB: yes
U22 = CMP-1061-00729-1: Transient Voltage Suppressor, ESD Protection Diodes with Low Clamping Voltage, 6-Pin TSOP, Pb-Free, Tape and Reel; Manufacturer: On Semiconductor; IR Max (uA): 5; Direction: Unidirectional; PPK Max (W): 300; DatasheetVersion: Rev. 1; ComponentLink2Description: Datasheet; ComponentLink3Description: Package Specification; ComponentLink1Description: Manufacturer URL; PartNumber: SRV05-4MR6T1G; PackageReference: TSOP-6-318G-02; PackageDescription: 6-Pin Small Outline Package, Body 3 x 1.5 mm, Pitch 0.95 mm; ComponentLink1URL: http://www.onsemi.com/; ComponentLink2URL: http://www.onsemi.com/pub_link/Collateral/SRV05-4-D.PDF; Packing: Tape and Reel; Mounting Technology: Surface Mount; ComponentLink3URL: http://www.onsemi.com/pub_link/Collateral/318G-02.PDF; PackageVersion: Rev. V, 06/2012; RoHS: Pb-Free
U23 U24 = WAFER-GH1.25-5PWB: Manufacturer: XUNPU(讯普); Add into BOM: yes; Pins Structure: 1x5P; Pitch: 1.25mm; Reference Series: GH; Number of PINs Per Row: 5; Current Rating (Max): 1A; Symbol: WAFER-GH1.25-5PWB; Device: WAFER-GH1.25-5PWB; LCSC Part Name: 1x5P 间距:1.25mm 卧贴 系列:GH; Supplier Part: C3029380; Manufacturer Part: WAFER-GH1.25-5PWB; Supplier Footprint: SMD,P=1.25mm,卧贴; JLCPCB Part Class: Extended Part; Datasheet: https://atta.szlcsc.com/upload/public/pdf/source/20220527/CB8773BFB0913C3B8ABD62CB38BA101A.pdf; Supplier: LCSC; Convert to PCB: yes; Mounting Style: 卧贴; Number of Pins: 5P; Number of Rows: 1; Operating Temperature Range: -25℃~+85℃